# EAGLE design StellaBlue_new_eagle7 (EAGLE 7.7.0)
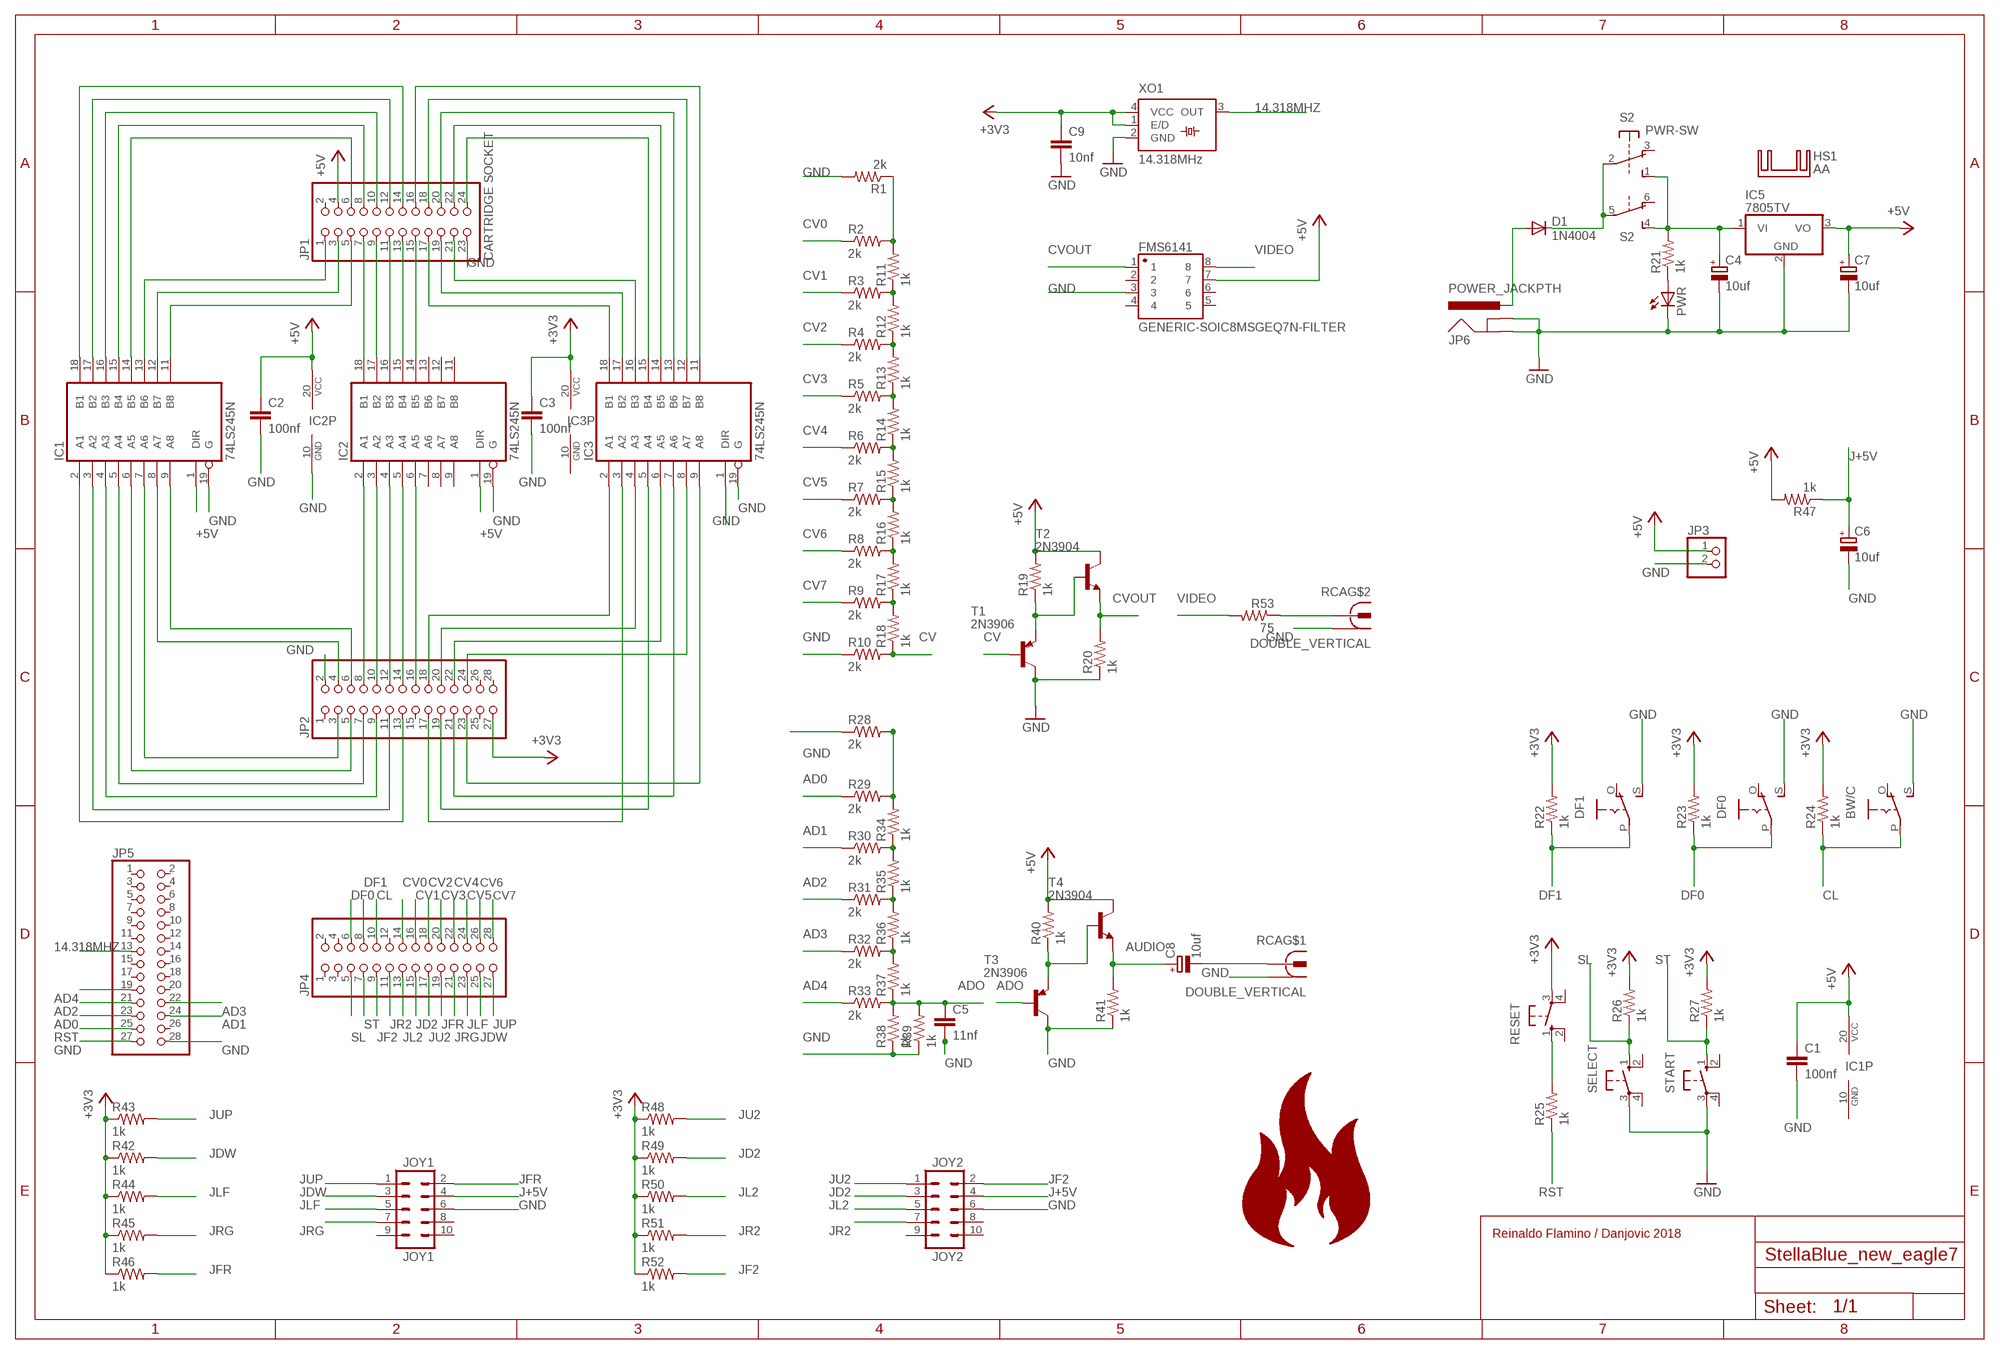
[diagram p0: schematic, sheet 1]

## Parts
BW/C  EG1218S  [EG1218]
C1  100nf  C5/2.5  [C5B2.5]
C2  100nf  C5/2.5  [C5B2.5]
C3  100nf  C5/2.5  [C5B2.5]
C4  10uf  CPOL-EUE2.5-6  [E2,5-6]
C5  11nf  C5/2.5  [C5B2.5]
C6  10uf  CPOL-EUTT2D6  [TT2D6]
C7  10uf  CPOL-EUE2.5-6  [E2,5-6]
C8  10uf  CPOL-EUE2.5-6  [E2,5-6]
C9  10nf  C5/2.5  [C5B2.5]
D1  1N4004  [DO41-10]
DF0  EG1218S  [EG1218]
DF1  EG1218S  [EG1218]
FMS6141  GENERIC-SOIC8MSGEQ7N-FILTER  [SO08]
HS1  AA  [AA]
IC1  74LS245N  [DIL20]
IC2  74LS245N  [DIL20]
IC3  74LS245N  [DIL20]
IC5  7805TV  [TO220V]
JOY1  JOY1  M05X2SHD_LOCK  [2X5-SHROUDED_LOCK]
JOY2  JOY2  M05X2SHD_LOCK  [2X5-SHROUDED_LOCK]
JP1  CARTRIDGE SOCKET  ATARI2600_SLOT  [ATARI2600_SLOT]
JP2  PINHD-2X14  [2X14]
JP3  PINHD-1X2/90  [1X02/90]
JP4  PINHD-2X14  [2X14]
JP5  PINHD-2X14  [2X14]
JP6  POWER_JACKPTH  [POWER_JACK_PTH]
PWR  LED3MM  [LED3MM]
R1  2k  R-US_0207/7  [0207/7]
R2  2k  R-US_0207/7  [0207/7]
R3  2k  R-US_0207/7  [0207/7]
R4  2k  R-US_0207/7  [0207/7]
R5  2k  R-US_0207/7  [0207/7]
R6  2k  R-US_0207/7  [0207/7]
R7  2k  R-US_0207/7  [0207/7]
R8  2k  R-US_0207/7  [0207/7]
R9  2k  R-US_0207/7  [0207/7]
R10  2k  R-US_0207/7  [0207/7]
R11  1k  R-US_0207/7  [0207/7]
R12  1k  R-US_0207/7  [0207/7]
R13  1k  R-US_0207/7  [0207/7]
R14  1k  R-US_0207/7  [0207/7]
R15  1k  R-US_0207/7  [0207/7]
R16  1k  R-US_0207/7  [0207/7]
R17  1k  R-US_0207/7  [0207/7]
R18  1k  R-US_0207/7  [0207/7]
R19  1k  R-US_0207/7  [0207/7]
R20  1k  R-US_0207/7  [0207/7]
R21  1k  R-US_0207/7  [0207/7]
R22  1k  R-US_0207/7  [0207/7]
R23  1k  R-US_0207/7  [0207/7]
R24  1k  R-US_0207/7  [0207/7]
R25  1k  R-US_0207/7  [0207/7]
R26  1k  R-US_0207/7  [0207/7]
R27  1k  R-US_0207/7  [0207/7]
R28  2k  R-US_0207/7  [0207/7]
R29  2k  R-US_0207/7  [0207/7]
R30  2k  R-US_0207/7  [0207/7]
R31  2k  R-US_0207/7  [0207/7]
R32  2k  R-US_0207/7  [0207/7]
R33  2k  R-US_0207/7  [0207/7]
R34  1k  R-US_0207/7  [0207/7]
R35  1k  R-US_0207/7  [0207/7]
R36  1k  R-US_0207/7  [0207/7]
R37  1k  R-US_0207/7  [0207/7]
R38  1k  R-US_0207/7  [0207/7]
R39  1k  R-US_0207/7  [0207/7]
R40  1k  R-US_0207/7  [0207/7]
R41  1k  R-US_0207/7  [0207/7]
R42  1k  R-US_0207/7  [0207/7]
R43  1k  R-US_0207/7  [0207/7]
R44  1k  R-US_0207/7  [0207/7]
R45  1k  R-US_0207/7  [0207/7]
R46  1k  R-US_0207/7  [0207/7]
R47  1k  R-US_0207/7  [0207/7]
R48  1k  R-US_0207/7  [0207/7]
R49  1k  R-US_0207/7  [0207/7]
R50  1k  R-US_0207/7  [0207/7]
R51  1k  R-US_0207/7  [0207/7]
R52  1k  R-US_0207/7  [0207/7]
R53  75  R-US_0207/7  [0207/7]
RCA  DOUBLE_VERTICAL  [DOUBLE-VERTICAL]
RESET  10-XX  [B3F-10XX]
S2  PWR-SW  9077-2  [9077-2]
SELECT  10-XX  [B3F-10XX]
START  10-XX  [B3F-10XX]
T1  2N3906  2N3906-PNP-TO92-EBC  [TO92-EBC]
T2  2N3904  2N3904-NPN-TO92-EBC  [TO92-EBC]
T3  2N3906  2N3906-PNP-TO92-EBC  [TO92-EBC]
T4  2N3904  2N3904-NPN-TO92-EBC  [TO92-EBC]
XO1  14.318MHz  SM77H  [SM77H]

## Nets
14.318MHZ: JP5.13 XO1.3(OUT)
+3V3: C3.1 C9.1 IC3.20(VCC) JP2.27 R22.2 R23.2 R24.2 R26.2 R27.2 R42.1 R43.1 R44.1 R45.1 R46.1 R48.1 R49.1 R50.1 R51.1 R52.1 RESET.3(P) XO1.1(E/D) XO1.4(VCC)
+5V: C1.1 C2.1 C7.+ FMS6141.7 IC1.1(DIR) IC1.20(VCC) IC2.1(DIR) IC2.20(VCC) IC5.3(VO) JP1.4 JP3.1 R19.2 R40.2 R47.2 T2.C T4.C
AD0: JP5.23 R29.1
AD1: JP5.24 R30.1
AD2: JP5.21 R31.1
AD3: JP5.22 R32.1
AD4: JP5.19 R33.1
ADO: C5.1 R33.2 R37.1 R38.2 R39.2 T3.B
AUDIO: C8.+ R41.2 T4.E
CL: BW/C.P JP4.10 R24.1
CV: R10.2 R18.1 T1.B
CV0: JP4.14 R2.1
CV1: JP4.16 R3.1
CV2: JP4.18 R4.1
CV3: JP4.20 R5.1
CV4: JP4.22 R6.1
CV5: JP4.24 R7.1
CV6: JP4.26 R8.1
CV7: JP4.28 R9.1
CVOUT: FMS6141.1 R20.2 T2.E
DF0: DF0.P JP4.6 R23.1
DF1: DF1.P JP4.8 R22.1
GND: BW/C.S C1.2 C2.2 C3.2 C4.- C5.2 C6.- C7.- C9.2 DF0.S DF1.S FMS6141.3 IC1.19(G) IC2.10(GND) IC2.19(G) IC3.1(DIR) IC3.19(G) IC5.2(GND) JOY1.6 JOY2.6 JP1.23 JP2.2 JP3.2 JP5.27 JP5.28 JP6.GND JP6.GNDBREAK PWR.K(C) R1.2 R10.1 R20.1 R28.1 R38.1 R39.1 R41.1 RCA.HG RCA.LG SELECT.3(P) START.3(P) T1.C T3.C XO1.2(GND)
J+5V: C6.+ JOY1.4 JOY2.4 R47.1
JD2: JOY2.3 JP4.15 R49.2
JDW: JOY1.3 JP4.25 R42.2
JF2: JOY2.2 JP4.9 R52.2
JFR: JOY1.2 JP4.19 R46.2
JL2: JOY2.5 JP4.13 R50.2
JLF: JOY1.5 JP4.23 R44.2
JR2: JOY2.7 JP4.11 R51.2
JRG: JOY1.7 JP4.21 R45.2
JU2: JOY2.1 JP4.17 R48.2
JUP: JOY1.1 JP4.27 R43.2
N$1: IC1.18(B1) JP1.14
N$2: IC1.17(B2) JP1.12
N$3: IC1.16(B3) JP1.10
N$4: IC1.15(B4) JP1.8
N$5: IC1.14(B5) JP1.6
N$6: IC1.13(B6) JP1.1
N$7: IC1.12(B7) JP1.3
N$8: IC1.11(B8) JP1.5
N$9: IC2.18(B1) JP1.7
N$10: IC2.17(B2) JP1.9
N$11: IC2.16(B3) JP1.11
N$12: IC2.15(B4) JP1.13
N$13: IC2.14(B5) JP1.15
N$14: IC3.18(B1) JP1.17
N$15: IC3.17(B2) JP1.19
N$16: IC3.16(B3) JP1.21
N$17: IC3.15(B4) JP1.24
N$18: IC3.14(B5) JP1.22
N$19: IC3.13(B6) JP1.20
N$20: IC3.12(B7) JP1.18
N$21: IC3.11(B8) JP1.16
N$22: IC1.2(A1) JP2.13
N$23: IC1.3(A2) JP2.11
N$24: IC1.4(A3) JP2.9
N$25: IC1.5(A4) JP2.7
N$26: IC1.6(A5) JP2.5
N$27: IC1.7(A6) JP2.3
N$28: IC1.8(A7) JP2.4
N$29: IC1.9(A8) JP2.6
N$30: IC2.2(A1) JP2.8
N$31: IC2.3(A2) JP2.10
N$32: IC2.4(A3) JP2.12
N$33: IC2.5(A4) JP2.14
N$34: IC2.6(A5) JP2.16
N$35: IC3.2(A1) JP2.18
N$36: IC3.3(A2) JP2.17
N$37: IC3.4(A3) JP2.20
N$38: IC3.5(A4) JP2.19
N$39: IC3.6(A5) JP2.22
N$40: IC3.7(A6) JP2.21
N$41: IC3.8(A7) JP2.24
N$42: IC3.9(A8) JP2.23
N$43: D1.A JP6.PWR
N$44: D1.C S2.2(1:P) S2.5(2:P)
N$45: R1.1 R2.2 R11.2
N$46: R3.2 R11.1 R12.2
N$47: R53.1 RCA.LS
N$49: C4.+ IC5.1(VI) R21.2 S2.1(1:S) S2.4(2:S)
N$50: R4.2 R12.1 R13.2
N$51: R5.2 R13.1 R14.2
N$52: R6.2 R14.1 R15.2
N$53: R7.2 R15.1 R16.2
N$54: R8.2 R16.1 R17.2
N$55: R9.2 R17.1 R18.2
N$57: R19.1 T1.E T2.B
N$58: PWR.A R21.1
N$59: R25.2 RESET.1(S)
N$62: R28.2 R29.2 R34.2
N$63: R30.2 R34.1 R35.2
N$64: R31.2 R35.1 R36.2
N$65: R32.2 R36.1 R37.2
N$67: R40.1 T3.E T4.B
N$68: C8.- RCA.HS
RST: JP5.25 R25.1
SL: JP4.5 R26.1 SELECT.1(S)
ST: JP4.7 R27.1 START.1(S)
VIDEO: FMS6141.8 R53.2
Unconnected: BW/C.O DF0.O DF1.O FMS6141.2 FMS6141.4 FMS6141.5 FMS6141.6 IC2.7(A6) IC2.8(A7) IC2.9(A8) IC2.11(B8) IC2.12(B7) IC2.13(B6) JOY1.8 JOY1.9 JOY1.10 JOY2.8 JOY2.9 JOY2.10 JP1.2 JP2.1 JP2.15 JP2.25 JP2.26 JP2.28 JP4.1 JP4.2 JP4.3 JP4.4 JP4.12 JP5.1 JP5.2 JP5.3 JP5.4 JP5.5 JP5.6 JP5.7 JP5.8 JP5.9 JP5.10 JP5.11 JP5.12 JP5.14 JP5.15 JP5.16 JP5.17 JP5.18 JP5.20 JP5.26 RESET.2(S1) RESET.4(P1) S2.3(1:O) S2.6(2:O) SELECT.2(S1) SELECT.4(P1) START.2(S1) START.4(P1)

## Notes on the sheet
- Reinaldo Flamino / Danjovic 2018

## Power pins joined to a net without a drawn wire
GND: IC1.10(GND) IC3.10(GND)

## Library data of the parts
BW/C DF0 DF1 = adafruit:EG1218: SLIDING SWITCH 0.1" spacing through hole, vertical SPDT slide switch http://www.ladyada.net/library/pcb/eaglelibrary.html
C1-C3 C5 C9 = capacitor-wima:C: CAPACITOR naming: grid - package width
C4 C6-C8 = resistor:CPOL-EU: POLARIZED CAPACITOR, European symbol
D1 = adafruit:1N4004: DIODE General purpose 1N400x type rectifier (With bigger pads) http://www.ladyada.net/library/pcb/eaglelibrary.html
FMS6141 = SparkFun-AnalogIC:GENERIC-SOIC8: A placeholder for generic narrow & wide SOIC8 foorptints - used on the DIP adapter board.; PROD_ID: IC-10141
HS1 = heatsink:AA
IC1-IC3 = 74xx-us:74*245: Octal BUS TRANSCEIVER, 3-state
IC5 = linear:78*: Positive VOLTAGE REGULATOR Source: http://cache.national.com/ds/LM/LM78L05.pdf http://www.fairchildsemi.com/ds/LM/LM7805.pdf
JOY1 JOY2 = SparkFun-Connectors:M05X2: Header 5x2 Standard 10-pin dual row 0.1" header. Commonly used with AVR-ISP. Use with Spark Fun Electronics SKU: PRT-00778
JP1 = atari2600 card edge:ATARI2600_SLOT: Atari 2600 Slot connector Based on Sullins card edge connector 12/24 pin
JP2 JP4 JP5 = pinhead:PINHD-2X14: PIN HEADER
JP3 = pinhead:PINHD-1X2: PIN HEADER
JP6 = SparkFun-Connectors:POWER_JACK: Power Jack This is the standard 5.5mm barrel jack for power. The PTH is the most common, proven, reliable, footprint. The Slot footprint only works if the mill layer is transmitted to the PCB fab house so be warned. Mating wall wart : TOL-00298 (and others); PROD_ID: CONN-08197
PWR = led:LED: LED OSRAM: - CHIPLED LG R971, LG N971, LY N971, LG Q971, LY Q971, LO R971, LY R971 LH N974, LH R974 LS Q976, LO Q976, LY Q976 LO Q996 - Hyper CHIPLED LW Q18S LB Q993, LB Q99A, LB R99A - SideLED LS A670, LO A670, LY A670, LG A670, LP A670 LB A673, LV A673, LT A673, LW A673 LH A674 LY A675 LS A676, LA A676, LO A676, LY A676, LW A676 LS A679, LY A679, LG A679 - Hyper Micro SIDELED® LS Y876, LA Y876, LO Y876, LY Y876 LT Y87S - SmartLED LW L88C, LW L88S LB L89C, LB L89S, LG L890 LS L89K, LO L89K, LY L89K LS L896, LA L896, LO L896, LY L896 - TOPLED LS T670, LO T670, LY T670, LG T670, LP T670 LSG T670, LSP T670, LSY T670, LOP T670, LYG T670 LG T671, LOG T671, LSG T671 LB T673, LV T673, LT T673, LW T673 LH T674 LS T676, LA T676, LO T676, LY T676, LB T676, LH T676, LSB T676, LW T676 LB T67C, LV T67C, LT T67C, LS T67K, LO T67K, LY T67K, LW E67C LS E67B, LA E67B, LO E67B, LY E67B, LB E67C, LV E67C, LT E67C LW T67C LS T679, LY T679, LG T679 LS T770, LO T770, LY T770, LG T770, LP T770 LB T773, LV T773, LT T773, LW T773 LH T774 LS E675, LA E675, LY E675, LS T675 LS T776, LA T776, LO T776, LY T776, LB T776 LHGB T686 LT T68C, LB T68C - Hyper Mini TOPLED® LB M676 - Mini TOPLED Santana® LG M470 LS M47K, LO M47K, LY M47K Source: http://www.osram.convergy.de LUXEON: - LUMILED® LXK2-PW12-R00, LXK2-PW12-S00, LXK2-PW14-U00, LXK2-PW14-V00 LXK2-PM12-R00, LXK2-PM12-S00, LXK2-PM14-U00 LXK2-PE12-Q00, LXK2-PE12-R00, LXK2-PE12-S00, LXK2-PE14-T00, LXK2-PE14-U00 LXK2-PB12-K00, LXK2-PB12-L00, LXK2-PB12-M00, LXK2-PB14-N00, LXK2-PB14-P00, LXK2-PB14-Q00 LXK2-PR12-L00, LXK2-PR12-M00, LXK2-PR14-Q00, LXK2-PR14-R00 LXK2-PD12-Q00, LXK2-PD12-R00, LXK2-PD12-S00 LXK2-PH12-R00, LXK2-PH12-S00 LXK2-PL12-P00, LXK2-PL12-Q00, LXK2-PL12-R00 Source: www.luxeon.com KINGBRIGHT: KA-3528ASYC Source: www.kingbright.com
R1-R53 = resistor:R-US_: RESISTOR, American symbol
RCA = con-rca-board:DOUBLE_VERTICAL
RESET SELECT START = switch-omron:10-XX: OMRON SWITCH; MPN: B3F-1000; OC_FARNELL: 176432; OC_NEWARK: 36M3542
S2 = switch-misc:9077-2: MARQUARDT SWITCH 9077.0200 Distributor: Buerklin <https://www.buerklin.com/default.asp?event=ShowArtikel%2812G2822%29&l=d&jump=ArtNr_12G2822>
T1 T3 = transistor-neu-to92:*-PNP-: PNP Transistror
T2 T4 = transistor-neu-to92:*-NPN-: NPN Transistror
XO1 = crystal:SM77H: 3.3V CMOS Clock Oscillator Source: www.pletronics.com .. sm77h%203.3v.pdf

## Board
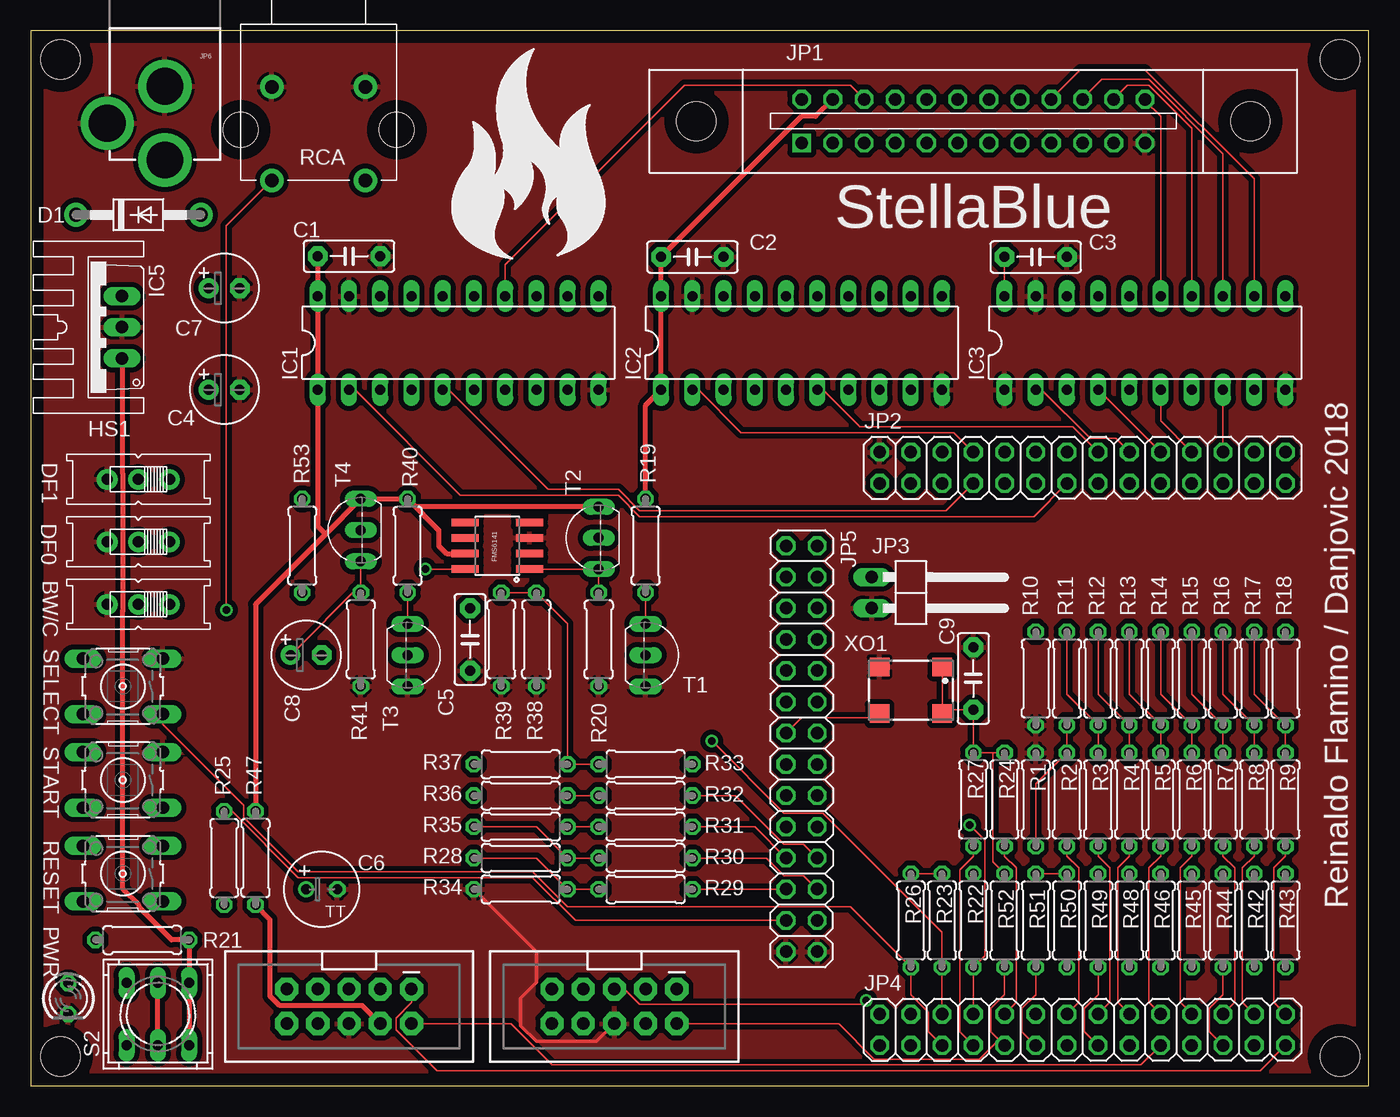
[diagram p1: board, top side]
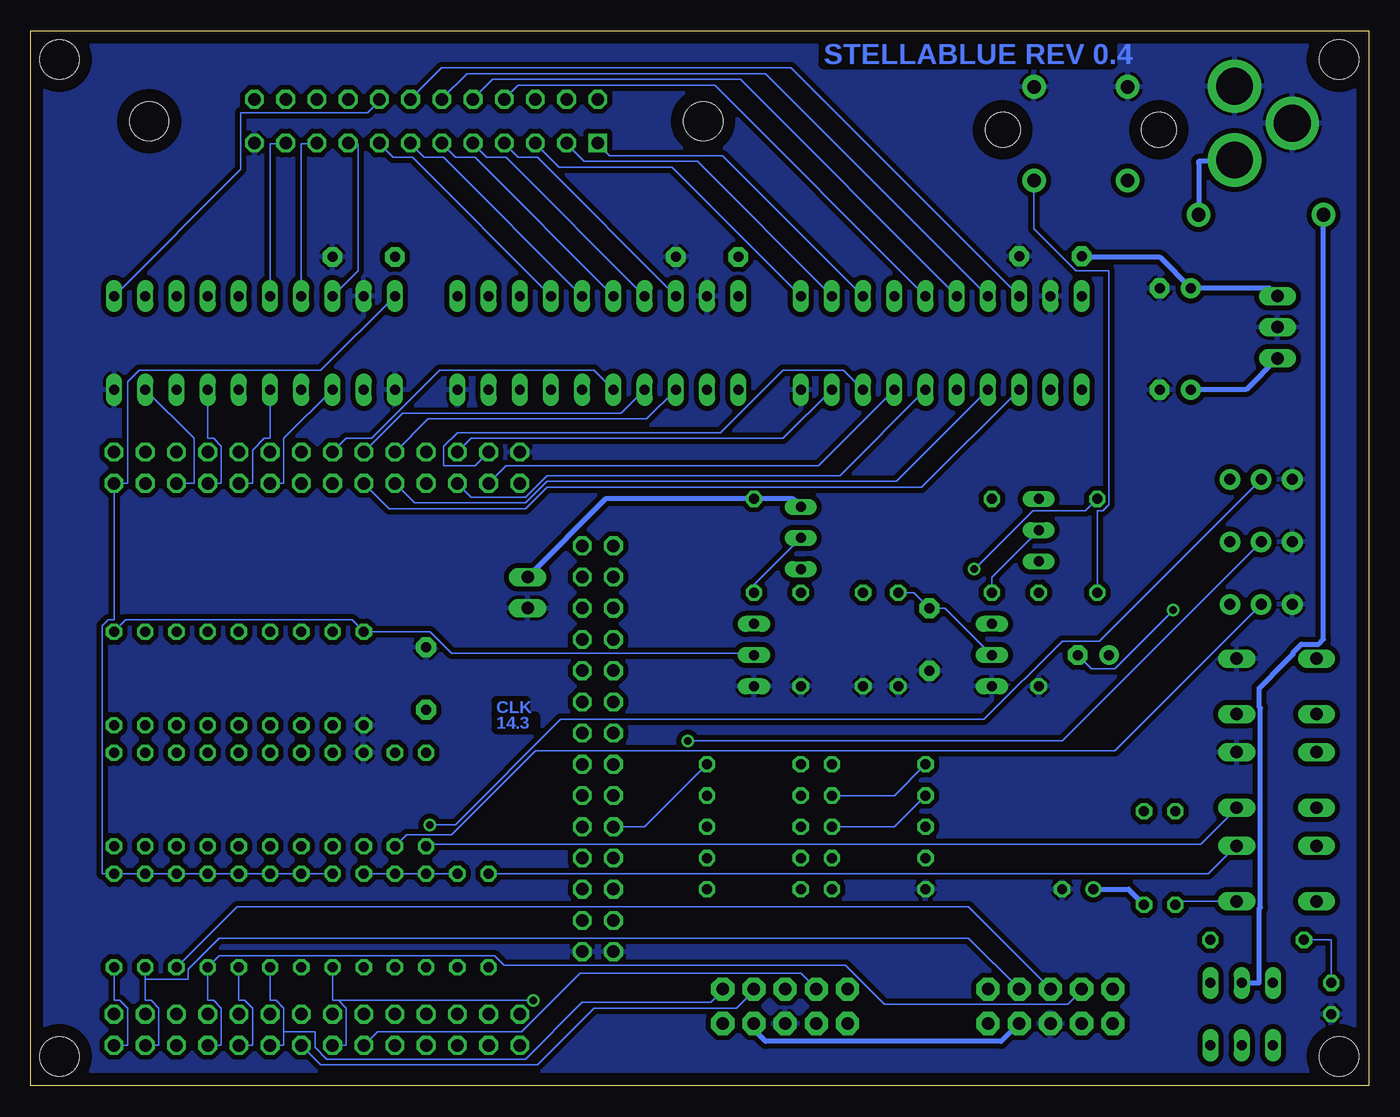
[diagram p2: board, bottom side, seen from below]

Size 108.89 x 85.84 mm. Coordinates in mm from the lower left corner, seen from the top.
Outline: 0,0 108.89,0 108.89,85.84 0,85.84 0,0
Copper layers (1*16): Top 0.035mm / dielectric 1.5mm / Bottom 0.035mm
Design rules "default *": minimum track width 5mil, minimum drill 24mil, track to track 8mil, track to pad 8mil, pad to pad 8mil, via to via 8mil, smd to smd 8mil, copper to edge 40mil, drill to drill 8mil, minimum pad ring 10mil, minimum via ring 8mil, stop-mask expansion 4mil, vias tented up to drill 0mil, thermal gap 10mil
Holes 3.2 mm at 2.41,83.5 2.41,2.41 106.55,2.41 106.55,83.5

### Footprints (pad centres in the part's own frame; a part is rotated, then mirrored left to right if it is on the bottom)
EG1218 = drill 0.9 pad 1.676: O -2.54,0; P 0,0; S 2.54,0
C5B2.5 = drill 0.813 pad 1.6 octagon: 1 -2.54,0; 2 2.54,0
E2,5-6 = drill 0.813 pad 1.6: + -1.27,0 | drill 0.813 pad 1.6 octagon: - 1.27,0
TT2D6 = drill 0.813: + -1.27,0 | drill 0.813 octagon: - 1.27,0
DO41-10 = drill 1.118 pad 1.93: A 5.08,0; C -5.08,0
SO08 = smd 0.61 x 2.21: 1 -1.905,-2.616; 2 -0.635,-2.616; 3 0.635,-2.616; 4 1.905,-2.616; 5 1.905,2.616; 6 0.635,2.616; 7 -0.635,2.616; 8 -1.905,2.616
DIL20 = drill 0.813 long: 1 -11.43,-3.81; 2 -8.89,-3.81; 3 -6.35,-3.81; 4 -3.81,-3.81; 5 -1.27,-3.81; 6 1.27,-3.81; 7 3.81,-3.81; 8 6.35,-3.81; 9 8.89,-3.81; 10 11.43,-3.81; 11 11.43,3.81; 12 8.89,3.81; 13 6.35,3.81; 14 3.81,3.81; 15 1.27,3.81; 16 -1.27,3.81; 17 -3.81,3.81; 18 -6.35,3.81; 19 -8.89,3.81; 20 -11.43,3.81
TO220V = drill 1.016 long: 1 -2.54,-2.54; 2 0,-2.54; 3 2.54,-2.54
2X5-SHROUDED_LOCK = drill 1.016 pad 1.88 octagon: 1 -1.397,5.08; 2 1.397,5.08; 3 -1.397,2.54; 4 1.397,2.54; 5 -1.397,0; 6 1.397,0; 7 -1.397,-2.54; 8 1.397,-2.54; 9 -1.397,-5.08; 10 1.397,-5.08
ATARI2600_SLOT = drill 1.016 square: 1 -13.97,-1.778 | drill 1.016 octagon: 2 -13.97,1.778; 3 -11.43,-1.778; 4 -11.43,1.778; 5 -8.89,-1.778; 6 -8.89,1.778; 7 -6.35,-1.778; 8 -6.35,1.778; 9 -3.81,-1.778; 10 -3.81,1.778; 11 -1.27,-1.778; 12 -1.27,1.778; 13 1.27,-1.778; 14 1.27,1.778; 15 3.81,-1.778; 16 3.81,1.778; 17 6.35,-1.778; 18 6.35,1.778; 19 8.89,-1.778; 20 8.89,1.778; 21 11.43,-1.778; 22 11.43,1.778; 23 13.97,-1.778; 24 13.97,1.778 | hole 3.175: -22.543,0; 22.543,0
2X14 = drill 1.016 octagon: 1 -16.51,-1.27; 2 -16.51,1.27; 3 -13.97,-1.27; 4 -13.97,1.27; 5 -11.43,-1.27; 6 -11.43,1.27; 7 -8.89,-1.27; 8 -8.89,1.27; 9 -6.35,-1.27; 10 -6.35,1.27; 11 -3.81,-1.27; 12 -3.81,1.27; 13 -1.27,-1.27; 14 -1.27,1.27; 15 1.27,-1.27; 16 1.27,1.27; 17 3.81,-1.27; 18 3.81,1.27; 19 6.35,-1.27; 20 6.35,1.27; 21 8.89,-1.27; 22 8.89,1.27; 23 11.43,-1.27; 24 11.43,1.27; 25 13.97,-1.27; 26 13.97,1.27; 27 16.51,-1.27; 28 16.51,1.27
1X02/90 = drill 1.016 long: 1 -1.27,-3.81; 2 1.27,-3.81
POWER_JACK_PTH = drill 2.997 pad 4.318: GND 0,7.7; GNDBREAK 4.7,10.7; PWR 0,13.7
LED3MM = drill 0.813 octagon: A -1.27,0; K 1.27,0
0207/7 = drill 0.813 octagon: 1 -3.81,0; 2 3.81,0
DOUBLE-VERTICAL = drill 1.1 pad 1.93: HG -3.81,3.81; HS -3.81,-3.81; LG 3.81,3.81; LS 3.81,-3.81 | hole 2.8: -6.35,0.318; 6.35,0.318
B3F-10XX = drill 1.016 long: 1 -3.251,2.261; 2 3.251,2.261; 3 -3.251,-2.261; 4 3.251,-2.261
9077-2 = drill 0.813 long: 1 -2.54,2.54; 2 0,2.54; 3 2.54,2.54; 4 -2.54,-2.54; 5 0,-2.54; 6 2.54,-2.54
TO92-EBC = drill 0.813 long: B 0,-1.27; C 2.54,-1.27; E -2.54,-1.27
SM77H = smd 1.6 x 1.5: 1 -2.55,-1.9; 2 2.55,-1.9; 3 2.55,1.9; 4 -2.55,1.9

### Placement (x,y rotation side)
BW/C  8.76,39.18 180 top
C1  25.91,67.5 0 top
C2  53.85,67.44 0 top
C3  81.79,67.44 0 top
C4  15.75,56.64 0 top
C5  35.75,36.32 270 top
C6  23.69,16 0 top
C7  15.75,64.9 0 top
C8  22.42,35.05 0 top
C9  76.71,33.15 90 top
D1  8.76,70.87 0 top
DF0  8.76,44.26 180 top
DF1  8.76,49.34 180 top
FMS6141  37.97,43.94 90 top
HS1  0.19,61.72 270 top
IC1  34.8,60.45 0 top
IC2  62.74,60.45 0 top
IC3  90.68,60.45 0 top
IC5  4.89,61.72 90 top
JOY1  25.91,6.48 270 top
JOY2  47.5,6.48 270 top
JP1  76.71,78.49 0 top
JP2  85.6,50.29 0 top
JP3  72.26,40.13 270 top
JP4  85.6,4.57 0 top
JP5  62.74,27.43 270 top
JP6  10.92,89.03 180 top
PWR  3.05,7.11 270 top
R1  81.79,23.3 90 top
R2  84.33,23.3 90 top
R3  86.87,23.3 90 top
R4  89.41,23.3 90 top
R5  91.95,23.3 90 top
R6  94.49,23.3 90 top
R7  97.03,23.3 90 top
R8  99.57,23.3 90 top
R9  102.11,23.3 90 top
R10  81.79,33.15 90 top
R11  84.33,33.15 270 top
R12  86.87,33.15 270 top
R13  89.41,33.15 270 top
R14  91.95,33.15 270 top
R15  94.49,33.15 270 top
R16  97.03,33.15 270 top
R17  99.57,33.15 270 top
R18  102.11,33.15 270 top
R19  50.04,43.94 90 top
R20  46.23,36.32 90 top
R21  9.08,11.87 0 top
R22  76.71,13.46 90 top
R23  74.17,13.46 90 top
R24  79.25,23.3 90 top
R25  15.75,18.54 270 top
R26  71.63,13.46 90 top
R27  76.71,23.3 90 top
R28  39.88,16 0 top
R29  50.04,16 180 top
R30  50.04,18.54 180 top
R31  50.04,21.08 180 top
R32  50.04,23.62 180 top
R33  50.04,26.16 180 top
R34  39.88,18.54 180 top
R35  39.88,21.08 180 top
R36  39.88,23.62 180 top
R37  39.88,26.16 180 top
R38  41.15,36.32 90 top
R39  38.29,36.32 90 top
R40  30.67,43.94 90 top
R41  26.86,36.32 90 top
R42  99.57,13.46 270 top
R43  102.11,13.46 270 top
R44  97.03,13.46 270 top
R45  94.49,13.46 270 top
R46  91.95,13.46 270 top
R47  18.29,18.54 90 top
R48  89.41,13.46 270 top
R49  86.87,13.46 270 top
R50  84.33,13.46 270 top
R51  81.79,13.46 270 top
R52  79.25,13.46 270 top
R53  22.1,43.94 90 top
RCA  23.43,77.47 0 top
RESET  7.49,17.27 180 top
S2  10.35,5.84 180 top
SELECT  7.49,32.51 180 top
START  7.49,24.89 180 top
T1  51.31,35.05 270 top
T2  44.96,44.58 90 top
T3  31.94,35.05 270 top
T4  25.59,45.21 90 top
XO1  71.63,32.19 180 top

### Tracks (layer width: path | path; a pad name or v marks a point on that pad's centre or on a via)
14.318MHZ
  Top 0.127: XO1.3 68.76,29.97 62.74,29.97 JP5.13
+3V3
  Top 0.127: C3.1 IC3.20 | R50.1 R51.1 | R24.2 78.3,27.11 | 78.3,27.11 R27.2 C9.1 74.49,30.61 XO1.4 XO1.1 | R23.2 R26.2 | 78.3,27.11 78.3,18.22 R52.1
  Bottom 0.127: R50.1 R49.1 R48.1 R46.1 R45.1 R44.1 R42.1 R43.1 103.06,17.27 103.06,37.43 102.58,37.91 102.11,37.91 JP2.27 101,49.02 101,57.28 100.04,58.23 85.28,58.23 IC3.20 | R23.2 R22.2 R52.1 R51.1 | R26.2 13.05,17.27 10.79,19.53 RESET.3
+5V
  Top 0.127: 34.8,43.31 FMS6141.7
  Top 0.406: C1.1 IC1.20 IC1.1 23.37,45.53 23.84,45.05 24,44.9 | 24,44.9 T4.C R40.2 | 24,44.9 18.29,39.18 R47.2 | R40.2 33.21,45.21 33.21,43.94 33.85,43.31 34.8,43.31 | T2.C 31.3,47.12 R40.2 | R19.2 50.04,55.37 IC2.1 IC2.20 C2.1 62.74,78.87 63.88,78.87 JP1.4
  Bottom 0.406: IC5.3 8.06,64.9 C7.+ 17.02,67.44 23.37,67.44 C1.1 | T2.C 46.86,47.75 R19.2 62.1,47.75 JP3.1
AD0
  Top 0.127: JP5.23 R29.1
AD1
  Top 0.127: R30.1 59.88,18.54 61.31,17.11 62.9,17.11 JP5.24
AD2
  Top 0.127: R31.1 58.93,21.08 JP5.21
AD3
  Top 0.127: R32.1 57.34,23.62 61.31,19.65 62.9,19.65 JP5.22
AD4
  Bottom 0.127: R33.1 58.93,21.08 JP5.19
ADO
  Top 0.127: R33.2 R37.1 43.69,37.59 R38.2 R39.2
  Bottom 0.127: T3.B 34.48,38.86 C5.1 37.02,40.13 R39.2
AUDIO
  Top 0.127: T4.E 26.86,40.77 | 26.86,40.77 C8.+ | 26.86,40.77 R41.2
CL
  Top 0.127: R24.1 79.25,18.7 80.2,17.75 80.2,6.79 JP4.10
  Bottom 0.127: BW/C.P 20.67,27.27 67.82,27.27 74.64,20.45 78.3,20.45 R24.1
CV
  Bottom 0.127: T1.B 50.2,35.21 74.64,35.21 76.39,36.96 R10.2 82.74,37.91 101.16,37.91 R18.1
CV0
  Top 0.127: R2.1 84.33,18.7 85.28,17.75 85.28,6.79 JP4.14
CV1
  Top 0.127: R3.1 86.87,18.7 87.82,17.75 87.82,6.79 JP4.16
CV2
  Top 0.127: R4.1 89.41,18.7 88.46,17.75 88.46,6.79 JP4.18
CV3
  Top 0.127: R5.1 91.95,18.7 90.99,17.75 90.99,6.79 JP4.20
CV4
  Top 0.127: R6.1 94.49,18.7 93.54,17.75 93.54,6.79 JP4.22
CV5
  Top 0.127: R7.1 97.03,18.7 97.98,17.75 97.98,6.79 JP4.24
CV6
  Top 0.127: R8.1 99.57,18.7 98.62,17.75 98.62,6.79 JP4.26
CV7
  Top 0.127: R9.1 102.11,18.7 101.16,17.75 101.16,6.79 JP4.28
CVOUT
  Top 0.127: FMS6141.1 T2.E R20.2
DF0  (via drill 0.61)
  Top 0.127: JP4.6 R23.1 74.17,12.51 64.48,22.19 61.31,22.19 v55.44,28.07
  Bottom 0.127: DF0.P 24.96,28.07 v55.44,28.07
DF1  (via drill 0.61)
  Top 0.127: JP4.8 R22.1 77.66,10.6 77.66,19.97 v76.39,21.24
  Bottom 0.127: DF1.P 21.94,36.16 24.96,36.16 31.3,29.81 65.75,29.81 74.33,21.24 v76.39,21.24
GND
  Top 0.305: JOY2.6 46.04,3.62 41.15,3.62 39.85,4.91 39.85,7.14 41.15,8.44 41.15,10.92 R28.1
  pour Bottom (isolate 0.406): 0,86.17 108.97,86.17 108.97,0 0,0
  pour Top (isolate 0.406): 0.32,85.85 109.28,85.85 108.97,0 0,0
J+5V
  Top 0.406: JOY1.4 27,6.53 20.27,6.53 19.48,7.32 19.48,13.54 R47.1
  Bottom 0.127: 50.04,5.05 JOY2.4
  Bottom 0.406: R47.1 19.56,16 C6.+ | JOY1.4 29.91,3.62 49.09,3.62 50.04,4.57 50.04,5.05
JD2
  Top 0.127: R49.2 86.87,7.43 85.76,6.32 85.76,4.41 JP4.15
  Bottom 0.127: JP4.15 85.28,1.71 67.66,1.71 63.05,6.32 51.47,6.32 50.04,7.75 JOY2.3
JDW
  Bottom 0.127: 99.57,8.7 99.57,6.95 99.09,6.95 98.46,6.32 98.46,3.3 JP4.25 | 99.57,8.7 R42.2 | 99.57,8.7 96.07,8.7 96.07,9.49 93.54,12.03 32.58,12.03 28.45,7.91 JOY1.3
JF2
  Top 0.127: R52.2 79.25,7.43 78.14,6.32 78.14,4.41 78.77,3.78 | 78.77,3.78 77.18,2.19 68.61,2.19 65.75,5.05 52.58,5.05 JOY2.2 | 78.77,3.78 JP4.9
JFR
  Top 0.127: JP4.19 90.36,1.71 42.42,1.71 39.08,5.05 30.99,5.05 JOY1.2
  Bottom 0.127: R46.2 91.95,6.95 91.47,6.95 90.84,6.32 90.84,3.3 JP4.19
JL2  (via drill 0.61)
  Top 0.127: v67.98,6.95 67.66,6.64 49.56,6.64 48.45,7.75 47.5,7.75 JOY2.5
  Bottom 0.127: R50.2 84.33,6.95 83.85,6.95 | 83.85,6.95 83.22,6.32 83.22,3.3 JP4.13 | 83.85,6.95 v67.98,6.95
JLF
  Top 0.127: R44.2 97.03,7.43 95.92,6.32 95.92,4.41 JP4.23
  Bottom 0.127: R44.2 92.11,14.57 32.58,14.57 25.91,7.91 JOY1.5
JR2
  Top 0.127: R51.2 81.79,7.43 80.68,6.32 80.68,4.41 JP4.11
  Bottom 0.127: JP4.11 80.68,4.41 68.93,4.41 64.17,9.18 46.23,9.18 44.96,7.91 JOY2.7
JRG
  Bottom 0.127: JP4.21 93.38,3.3 93.38,6.32 94.01,6.95 94.49,6.95 R45.2 93.54,10.6 71.15,10.6 70.36,9.81 42.58,9.81 39.4,6.64 24.48,6.64 23.37,7.75 JOY1.7
JU2
  Bottom 0.127: R48.2 89.41,6.95 88.93,6.95 88.3,6.32 88.3,4.41 | 88.3,4.41 88.3,3.3 JP4.17 | 88.3,4.41 85.76,4.41 85.76,3.14 84.8,2.19 68.61,2.19 64.01,6.79 53.53,6.79 52.58,7.75 JOY2.1
JUP
  Top 0.127: JOY1.1 30.99,6.79 29.72,5.53 29.72,4.57 33.05,1.24 100.04,1.24 JP4.27
  Bottom 0.127: R43.2 102.11,6.95 101.63,6.95 101,6.32 101,3.3 JP4.27
N$1
  Bottom 0.127: IC1.18 47.02,82.84 75.44,82.84 77.98,80.3 JP1.14
N$2
  Bottom 0.127: IC1.17 49.09,82.36 73.37,82.36 75.44,80.3 JP1.12
N$3
  Bottom 0.127: IC1.16 51.15,81.88 71.31,81.88 72.9,80.3 JP1.10
N$4
  Bottom 0.127: IC1.15 53.21,81.41 69.25,81.41 70.36,80.3 JP1.8
N$5
  Top 0.127: IC1.14 38.61,66.8 53.21,81.41 66.71,81.41 67.82,80.3 JP1.6
N$6
  Bottom 0.127: IC1.13 52.58,75.69 61.79,75.69 62.74,76.64 JP1.1
N$7
  Bottom 0.127: IC1.12 54.64,75.22 63.85,75.22 65.28,76.64 JP1.3
N$8
  Bottom 0.127: IC1.11 56.71,74.74 65.91,74.74 67.82,76.64 JP1.5
N$9
  Bottom 0.127: IC2.18 67.66,75.53 69.25,75.53 70.36,76.64 JP1.7
N$10
  Bottom 0.127: IC2.17 70.2,75.53 71.79,75.53 72.9,76.64 JP1.9
N$11
  Bottom 0.127: IC2.16 72.74,75.53 74.33,75.53 75.44,76.64 JP1.11
N$12
  Bottom 0.127: IC2.15 75.28,75.53 76.87,75.53 77.98,76.64 JP1.13
N$13
  Bottom 0.127: IC2.14 77.82,75.53 79.41,75.53 80.52,76.64 JP1.15
N$14
  Bottom 0.127: IC3.18 82.26,66.33 82.26,76.64 83.06,76.64 JP1.17
N$15
  Bottom 0.127: IC3.17 86.87,76.64 85.6,76.64 JP1.19
N$16
  Bottom 0.127: IC3.16 89.41,76.64 88.14,76.64 JP1.21
N$17
  Top 0.127: IC3.15 91.95,78.87 90.68,80.14 JP1.24
N$18
  Top 0.127: IC3.14 94.49,77.92 90.99,81.41 89.25,81.41 88.14,80.3 JP1.22
N$19
  Top 0.127: IC3.13 97.03,75.85 90.99,81.88 87.19,81.88 85.6,80.3 JP1.20
N$20
  Top 0.127: IC3.12 99.57,73.79 90.68,82.68 85.44,82.68 83.06,80.3 JP1.18
N$21
  Bottom 0.127: IC3.11 91.79,74.58 91.79,79.18 81.47,79.18 80.52,80.14 JP1.16
N$22
  Top 0.127: IC1.2 26.38,56.64 34.96,48.07 47.82,48.07 49.56,46.32 81.63,46.32 JP2.13
N$23
  Bottom 0.127: IC1.3 36.39,48.7 66.87,48.7 68.61,46.96 79.72,46.96 JP2.11
N$24
  Bottom 0.127: IC1.4 38.45,49.18 66.87,49.18 68.61,47.43 77.66,47.43 JP2.9
N$25
  Top 0.127: IC1.5 34,56.64 42.1,48.55 47.82,48.55 49.56,46.8 74.49,46.8 JP2.7
N$26
  Bottom 0.127: IC1.6 43.05,49.66 66.87,49.66 68.61,47.91 73.06,47.91 JP2.5
N$27
  Bottom 0.127: IC1.7 44.8,50.45 70.2,50.45 JP2.3
N$28
  Bottom 0.127: IC1.8 42.73,58.23 47.66,58.23 52.74,53.15 74.17,53.15 75.28,52.04 75.28,50.45 72.74,50.45 JP2.4
N$29
  Bottom 0.127: IC1.9 47.66,52.67 73.06,52.67 JP2.6
N$30
  Top 0.127: IC2.2 54.32,56.64 57.82,53.15 75.12,53.15 JP2.8
N$31
  Bottom 0.127: IC2.3 58.77,54.26 76.55,54.26 JP2.10
N$32
  Bottom 0.127: IC2.4 60.83,54.74 78.61,54.74 JP2.12
N$33
  Bottom 0.127: IC2.5 63.05,58.23 75.6,58.23 81.15,52.67 83.22,52.67 JP2.14
N$34
  Top 0.127: IC2.6 64.48,56.64 67.5,53.63 84.8,53.63 JP2.16
N$35
  Top 0.127: IC3.2 82.26,56.64 86.23,52.67 88.3,52.67 JP2.18
N$36
  Bottom 0.127: IC3.3 88.3,52.67 88.3,49.02 JP2.17
N$37
  Top 0.127: JP2.20 IC3.4
N$38
  Bottom 0.127: IC3.5 89.41,52.67 89.88,52.67 90.84,51.72 90.84,49.02 JP2.19
N$39
  Top 0.127: IC3.6 91.95,54.1 JP2.22
N$40
  Bottom 0.127: IC3.7 94.49,52.67 94.01,52.67 93.38,52.04 93.38,49.02 JP2.21
N$41
  Top 0.127: JP2.24 IC3.8
N$42
  Bottom 0.127: IC3.9 95.6,52.67 95.6,49.02 JP2.23
N$43
  Bottom 0.127: 13.84,75.22 13.84,75.06 | 13.84,70.93 D1.A
  Bottom 0.406: JP6.PWR 11.03,75.22 13.84,75.22 | 13.84,75.06 13.84,70.93
N$44
  Top 0.406: S2.2 S2.5
  Bottom 0.127: 6.86,34.42 | 6.86,34.42
  Bottom 0.406: S2.5 8.92,8.38 8.92,14.42 8.81,14.53 8.81,30.73 8.92,30.84 8.92,32.35 6.86,34.42 6.17,35.1 6.17,35.26 5.49,35.94 4.06,35.94 3.68,36.32 D1.C
N$45
  Top 0.127: R1.1 81.79,24.57 R2.2 R11.2
N$46
  Top 0.127: R3.2 R12.2 84.33,31.88 R11.1
N$47
  Bottom 0.127: R53.1 22.1,46.8 21.62,46.8 21.14,47.28 21.14,66.33 23.84,66.33 27.24,69.72 RCA.LS
N$49
  Top 0.406: S2.1 S2.4 R21.2 11.47,11.88 8.81,14.53 8.81,14.68 7.49,16 7.49,38.64 7.47,38.66 7.47,49.86 7.47,59.14 IC5.1
  Bottom 0.406: IC5.1 9.97,56.64 C4.+
N$50
  Top 0.127: R4.2 R13.2 86.87,31.88 R12.1
N$51
  Top 0.127: R5.2 R14.2 89.41,31.88 R13.1
N$52
  Top 0.127: R6.2 R15.2 91.95,31.88 R14.1
N$53
  Top 0.127: R7.2 R16.2 94.49,31.88 R15.1
N$54
  Top 0.127: R8.2 R17.2 97.03,31.88 R16.1
N$55
  Top 0.127: R9.2 R18.2 99.57,31.88 R17.1
N$57
  Top 0.127: R19.1 T1.E
  Bottom 0.127: T2.B 50.04,40.77 R19.1
N$58
  Bottom 0.127: PWR.A 3.05,11.88 R21.1
N$59
  Bottom 0.127: R25.2 15.47,15.01 RESET.1
N$62
  Top 0.127: R34.2 41.15,18.54 R28.2 R29.2
N$63
  Top 0.127: R35.2 41.15,21.08 R34.1 R30.2
N$64
  Top 0.127: R35.1 R31.2
  Bottom 0.127: R36.2 38.61,21.08 R35.1
N$65
  Top 0.127: R36.1 R32.2
  Bottom 0.127: R37.2 38.61,23.62 R36.1
N$67
  Top 0.127: R40.1 T3.E
  Bottom 0.127: T4.B 30.67,41.4 R40.1
N$68  (via drill 0.61)
  Top 0.127: v15.91,38.7 15.91,69.98 19.59,73.66 RCA.HS
  Bottom 0.127: C8.- 22.57,33.94 20.67,33.94 v15.91,38.7
RST
  Top 0.127: R25.1 16.38,22.35 21.78,16.95 40.83,16.95 44.32,13.46 JP5.25
SL
  Top 0.127: JP4.5 73.06,4.41 73.06,6 71.63,7.43 R26.1 66.71,14.57 43.69,14.57 40.83,17.43 21.78,17.43 17.34,21.88 17.34,22.83 10.74,29.42 SELECT.1
ST
  Top 0.127: R27.1 76.71,18.7 75.6,17.59 75.6,4.41 JP4.7
  Bottom 0.127: R27.1 76.55,19.65 13.68,19.65 10.74,22.59 START.1
VIDEO  (via drill 0.61)
  Top 0.127: v32.1,42.04 FMS6141.8
  Bottom 0.127: v32.1,42.04 27.34,46.8 23.05,46.8 R53.2

### Text on the board
Bottom: STELLABLUE REV 0.4 | CLK | 14.3
tPlace: StellaBlue | Reinaldo Flamino / Danjovic 2018
tDocu: GND